# Altium schematic sheet AFE.SchDoc
size A; SheetNumber: 5; SheetTotal: 9
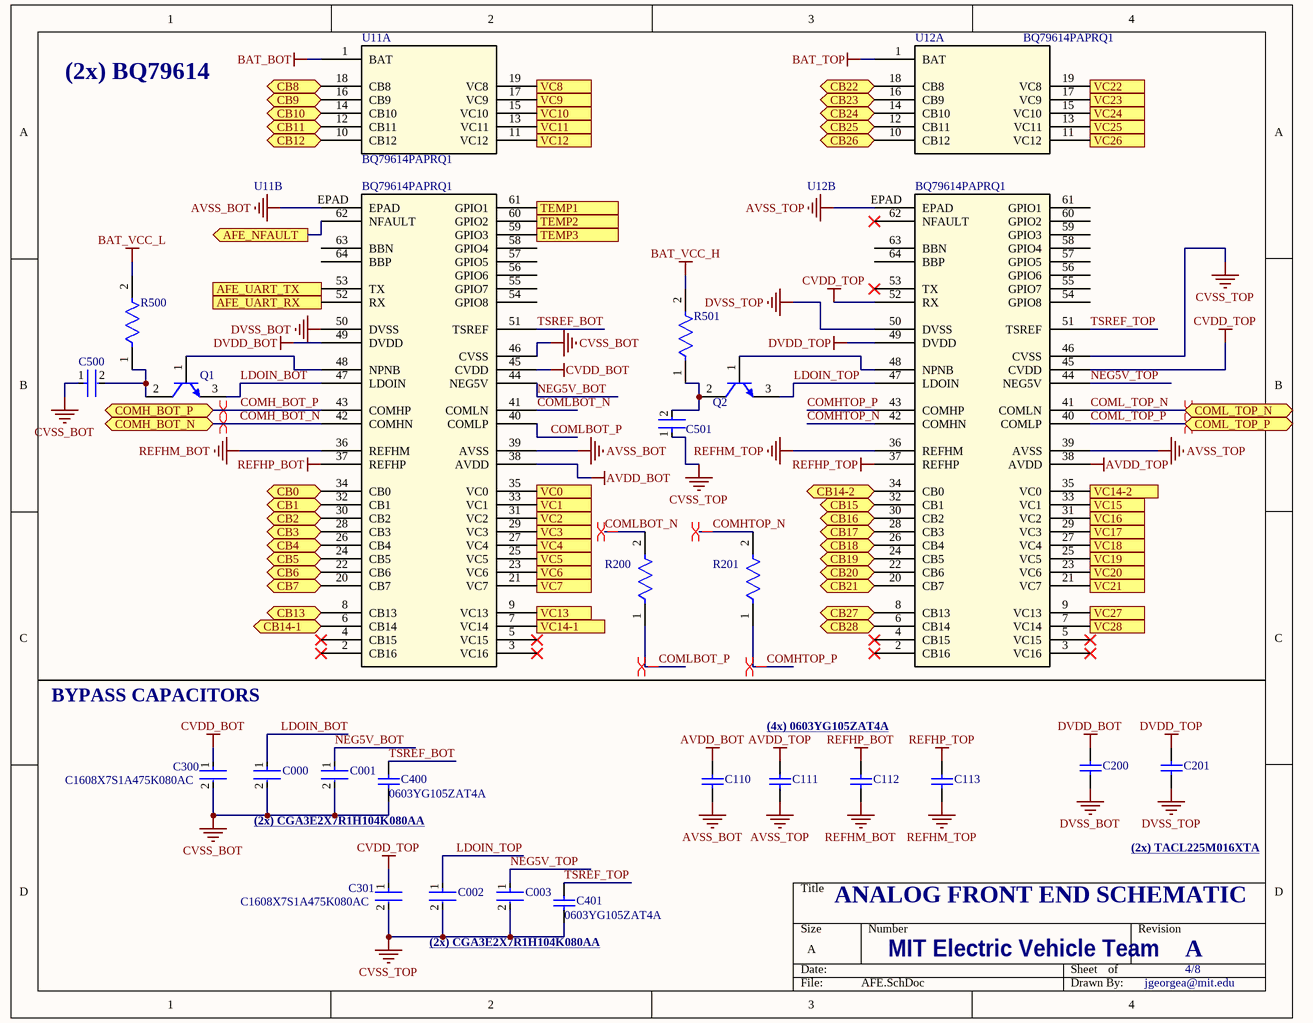
[diagram p0: AFE.SchDoc]

## Parts
C000  CGA3E2X7R1H104K080AA  [FP-CGA3E-0_3-0_1-IPC_A]  (value not drawn)
C001  CGA3E2X7R1H104K080AA  [FP-CGA3E-0_3-0_1-IPC_A]  (value not drawn)
C002  CGA3E2X7R1H104K080AA  [FP-CGA3E-0_3-0_1-IPC_A]  (value not drawn)
C003  CGA3E2X7R1H104K080AA  [FP-CGA3E-0_3-0_1-IPC_A]  (value not drawn)
C110  0603YG105ZAT4A  [CAPC1608X90X35ML15T15]  (value not drawn)
C111  0603YG105ZAT4A  [CAPC1608X90X35ML15T15]  (value not drawn)
C112  0603YG105ZAT4A  [CAPC1608X90X35ML15T15]  (value not drawn)
C113  0603YG105ZAT4A  [CAPC1608X90X35ML15T15]  (value not drawn)
C200  TACL225M016XTA  [CAPC1609X100X15ML20]  (value not drawn)
C201  TACL225M016XTA  [CAPC1609X100X15ML20]  (value not drawn)
C300  C1608X7S1A475K080AC  [FP-C1608-080-MFG]
C301  C1608X7S1A475K080AC  [FP-C1608-080-MFG]
C400  0603YG105ZAT4A  [CAPC1608X90X35ML15T15]
C401  0603YG105ZAT4A  [CAPC1608X90X35ML15T15]
C500  C0805C224J1RACTU  [FP-C0805C-DN-MFG]  (value not drawn)
C501  C0805C224J1RACTU  [FP-C0805C-DN-MFG]  (value not drawn)
Q1  2SC3646T-TD-E  [ONSC-SOT-89_PCP-1-3-419AU_V]  (value not drawn)
Q2  2SC3646T-TD-E  [ONSC-SOT-89_PCP-1-3-419AU_V]  (value not drawn)
R200  RC1608J102CS  [FP-RC1608-IPC_A]  (value not drawn)
R201  RC1608J102CS  [FP-RC1608-IPC_A]  (value not drawn)
R500  PCAN1206E1500BST5  [FP-PCAN1206-MFG]  (value not drawn)
R501  PCAN1206E1500BST5  [FP-PCAN1206-MFG]  (value not drawn)
U11  BQ79614PAPRQ1  [QFP_4PAPRQ1_TEX]  (parts A,B of 2)
U12  BQ79614PAPRQ1  [QFP_4PAPRQ1_TEX]  (parts A,B of 2)

## Ports
AFE_NFAULT (out, see BMS_top_level[2C], Communication[1C]), AFE_UART_RX (in, see BMS_top_level[2C], Communication[1C]), AFE_UART_TX (out, see BMS_top_level[2C], Communication[1B]), CB0 (bidir, see BMS_top_level[2A], Cell_Balancing[2A]), CB1 (bidir, see BMS_top_level[2A], Cell_Balancing[2A]), CB2 (bidir, see BMS_top_level[2A], Cell_Balancing[2A]), CB3 (bidir, see BMS_top_level[2A], Cell_Balancing[2B]), CB4 (bidir, see BMS_top_level[2A], Cell_Balancing[2B]), CB5 (bidir, see BMS_top_level[2A], Cell_Balancing[2B]), CB6 (bidir, see BMS_top_level[2A], Cell_Balancing[2C]), CB7 (bidir, see BMS_top_level[2A], Cell_Balancing[2C]), CB8 (bidir, see BMS_top_level[2A], Cell_Balancing[2C]), CB9 (bidir, see BMS_top_level[2A], Cell_Balancing[2D]), CB10 (bidir, see BMS_top_level[2A], Cell_Balancing[2D]), CB11 (bidir, see BMS_top_level[2A], Cell_Balancing[3A]), CB12 (bidir, see BMS_top_level[2A], Cell_Balancing[3A]), CB13 (bidir, see BMS_top_level[2A], Cell_Balancing[3A]), CB14-1 (bidir, see BMS_top_level[2B], Cell_Balancing[3B]), CB14-2 (bidir, see BMS_top_level[2B], Cell_Balancing[3B]), CB15 (bidir, see BMS_top_level[2B], Cell_Balancing[3B]), CB16 (bidir, see BMS_top_level[2B], Cell_Balancing[3C]), CB17 (bidir, see BMS_top_level[2B], Cell_Balancing[3C]), CB18 (bidir, see BMS_top_level[2B], Cell_Balancing[3C]), CB19 (bidir, see BMS_top_level[2B], Cell_Balancing[3D]), CB20 (bidir, see BMS_top_level[2B], Cell_Balancing[3D]), CB21 (bidir, see BMS_top_level[2B], Cell_Balancing[4A]), CB22 (bidir, see BMS_top_level[2B], Cell_Balancing[4A]), CB23 (bidir, see BMS_top_level[2B], Cell_Balancing[4A]), CB24 (bidir, see BMS_top_level[2B], Cell_Balancing[4B]), CB25 (bidir, see BMS_top_level[2B], Cell_Balancing[4B]), CB26 (bidir, see BMS_top_level[2B], Cell_Balancing[4B]), CB27 (bidir, see BMS_top_level[2B], Cell_Balancing[4C]), CB28 (bidir, see BMS_top_level[2B], Cell_Balancing[4C]), COMH_BOT_N (bidir, see BMS_top_level[2C], Communication[1B]), COMH_BOT_P (bidir, see BMS_top_level[2C], Communication[1A]), COML_TOP_N (bidir, see BMS_top_level[2C], Communication[3B]), COML_TOP_P (bidir, see BMS_top_level[2C], Communication[3A]), TEMP1 (in, see BMS_top_level[2B], Connectors#1[1C]), TEMP2 (in, see BMS_top_level[2B], Connectors#1[1C]), TEMP3 (in, see BMS_top_level[2B], Connectors#1[1C]), VC0 (in, see BMS_top_level[2C], Voltage_Sensing[1A]), VC1 (in, see BMS_top_level[2C], Voltage_Sensing[1A]), VC2 (in, see BMS_top_level[2C], Voltage_Sensing[1A]), VC3 (in, see BMS_top_level[2C], Voltage_Sensing[1B]), VC4 (in, see BMS_top_level[2C], Voltage_Sensing[1B]), VC5 (in, see BMS_top_level[2C], Voltage_Sensing[1B]), VC6 (in, see BMS_top_level[2C], Voltage_Sensing[1C]), VC7 (in, see BMS_top_level[2C], Voltage_Sensing[1C]), VC8 (in, see BMS_top_level[2C], Voltage_Sensing[1C]), VC9 (in, see BMS_top_level[2C], Voltage_Sensing[1D]), VC10 (in, see BMS_top_level[2C], Voltage_Sensing[1D]), VC11 (in, see BMS_top_level[2C], Voltage_Sensing[3A]), VC12 (in, see BMS_top_level[2C], Voltage_Sensing[3A]), VC13 (in, see BMS_top_level[2C], Voltage_Sensing[3A]), VC14-1 (in, see BMS_top_level[2C], Voltage_Sensing[3B]), VC14-2 (in, see BMS_top_level[2C], Voltage_Sensing[3B]), VC15 (in, see BMS_top_level[2D], Voltage_Sensing[3B]), VC16 (in, see BMS_top_level[2D], Voltage_Sensing[3C]), VC17 (in, see BMS_top_level[2D], Voltage_Sensing[3C]), VC18 (in, see BMS_top_level[2D], Voltage_Sensing[3C]), VC19 (in, see BMS_top_level[2D], Voltage_Sensing[3D]), VC20 (in, see BMS_top_level[2D], Voltage_Sensing[3D]), VC21 (in, see BMS_top_level[2D], Voltage_Sensing[4A]), VC22 (in, see BMS_top_level[2D], Voltage_Sensing[4A]), VC23 (in, see BMS_top_level[2D], Voltage_Sensing[4A]), VC24 (in, see BMS_top_level[2D], Voltage_Sensing[4B]), VC25 (in, see BMS_top_level[2D], Voltage_Sensing[4B]), VC26 (in, see BMS_top_level[2D], Voltage_Sensing[4B]), VC27 (in, see BMS_top_level[2D], Voltage_Sensing[4C]), VC28 (in, see BMS_top_level[2D], Voltage_Sensing[4C])

## Nets
AVDD_BOT: C110.2 U11.38(AVDD)
AVDD_TOP: C111.2 U12.38(AVDD)
AVSS_BOT: C110.1 U11.39(AVSS) U11.EPAD
AVSS_TOP: C111.1 U12.39(AVSS) U12.EPAD
BAT_BOT: U11.1(BAT)
BAT_TOP: U12.1(BAT)
BAT_VCC_H: R501.2
BAT_VCC_L: R500.2
CVDD_BOT: C300.1 U11.45(CVDD)
CVDD_TOP: C301.1 U12.45(CVDD) U12.52(RX)
CVSS_BOT: C000.2 C001.2 C300.2 C400.1 C500.1 U11.46(CVSS)
CVSS_TOP: C002.2 C003.2 C301.2 C401.1 C501.1 U12.46(CVSS)
DVDD_BOT: C200.1 U11.49(DVDD)
DVDD_TOP: C201.1 U12.49(DVDD)
DVSS_BOT: C200.2 U11.50(DVSS)
DVSS_TOP: C201.2 U12.50(DVSS)
REFHM_BOT: C112.1 U11.36(REFHM)
REFHM_TOP: C113.1 U12.36(REFHM)
REFHP_BOT: C112.2 U11.37(REFHP)
REFHP_TOP: C113.2 U12.37(REFHP)
AFE_NFAULT: U11.62(NFAULT) ; port AFE_NFAULT
AFE_UART_RX: U11.52(RX) ; port AFE_UART_RX
AFE_UART_TX: U11.53(TX) ; port AFE_UART_TX
CB0: U11.34(CB0) ; port CB0
CB1: U11.32(CB1) ; port CB1
CB2: U11.30(CB2) ; port CB2
CB3: U11.28(CB3) ; port CB3
CB4: U11.26(CB4) ; port CB4
CB5: U11.24(CB5) ; port CB5
CB6: U11.22(CB6) ; port CB6
CB7: U11.20(CB7) ; port CB7
CB8: U11.18(CB8) ; port CB8
CB9: U11.16(CB9) ; port CB9
CB10: U11.14(CB10) ; port CB10
CB11: U11.12(CB11) ; port CB11
CB12: U11.10(CB12) ; port CB12
CB13: U11.8(CB13) ; port CB13
CB14-1: U11.6(CB14) ; port CB14-1
CB14-2: U12.34(CB0) ; port CB14-2
CB15: U12.32(CB1) ; port CB15
CB16: U12.30(CB2) ; port CB16
CB17: U12.28(CB3) ; port CB17
CB18: U12.26(CB4) ; port CB18
CB19: U12.24(CB5) ; port CB19
CB20: U12.22(CB6) ; port CB20
CB21: U12.20(CB7) ; port CB21
CB22: U12.18(CB8) ; port CB22
CB23: U12.16(CB9) ; port CB23
CB24: U12.14(CB10) ; port CB24
CB25: U12.12(CB11) ; port CB25
CB26: U12.10(CB12) ; port CB26
CB27: U12.8(CB13) ; port CB27
CB28: U12.6(CB14) ; port CB28
COMH_BOT_N: U11.42(COMHN) ; port COMH_BOT_N
COMH_BOT_P: U11.43(COMHP) ; port COMH_BOT_P
COMHTOP_N: R201.2 U12.42(COMHN)
COMHTOP_P: R201.1 U12.43(COMHP)
COML_TOP_N: U12.41(COMLN) ; port COML_TOP_N
COML_TOP_P: U12.40(COMLP) ; port COML_TOP_P
COMLBOT_N: R200.2 U11.41(COMLN)
COMLBOT_P: R200.1 U11.40(COMLP)
LDOIN_BOT: C000.1 Q1.3(E) U11.47(LDOIN)
LDOIN_TOP: C002.1 Q2.3(E) U12.47(LDOIN)
NEG5V_BOT: C001.1 U11.44(NEG5V)
NEG5V_TOP: C003.1 U12.44(NEG5V)
TEMP1: U11.61(GPIO1) ; port TEMP1
TEMP2: U11.60(GPIO2) ; port TEMP2
TEMP3: U11.59(GPIO3) ; port TEMP3
TSREF_BOT: C400.2 U11.51(TSREF)
TSREF_TOP: C401.2 U12.51(TSREF)
VC0: U11.35(VC0) ; port VC0
VC1: U11.33(VC1) ; port VC1
VC2: U11.31(VC2) ; port VC2
VC3: U11.29(VC3) ; port VC3
VC4: U11.27(VC4) ; port VC4
VC5: U11.25(VC5) ; port VC5
VC6: U11.23(VC6) ; port VC6
VC7: U11.21(VC7) ; port VC7
VC8: U11.19(VC8) ; port VC8
VC9: U11.17(VC9) ; port VC9
VC10: U11.15(VC10) ; port VC10
VC11: U11.13(VC11) ; port VC11
VC12: U11.11(VC12) ; port VC12
VC13: U11.9(VC13) ; port VC13
VC14-1: U11.7(VC14) ; port VC14-1
VC14-2: U12.35(VC0) ; port VC14-2
VC15: U12.33(VC1) ; port VC15
VC16: U12.31(VC2) ; port VC16
VC17: U12.29(VC3) ; port VC17
VC18: U12.27(VC4) ; port VC18
VC19: U12.25(VC5) ; port VC19
VC20: U12.23(VC6) ; port VC20
VC21: U12.21(VC7) ; port VC21
VC22: U12.19(VC8) ; port VC22
VC23: U12.17(VC9) ; port VC23
VC24: U12.15(VC10) ; port VC24
VC25: U12.13(VC11) ; port VC25
VC26: U12.11(VC12) ; port VC26
VC27: U12.9(VC13) ; port VC27
VC28: U12.7(VC14) ; port VC28
NetC500_2: C500.2 Q1.2(C) R500.1
NetC501_2: C501.2 Q2.2(C) R501.1
NetQ1_1: Q1.1(B) U11.48(NPNB)
NetQ2_1: Q2.1(B) U12.48(NPNB)

Not connected (* = marked no-connect by the designer): U11 2(CB16)* 3(VC16)* 4(CB15)* 5(VC15)* 54(GPIO8) 55(GPIO7) 56(GPIO6) 57(GPIO5) 58(GPIO4) 63(BBN) 64(BBP); U12 2(CB16)* 3(VC16)* 4(CB15)* 5(VC15)* 53(TX)* 54(GPIO8) 55(GPIO7) 56(GPIO6) 57(GPIO5) 58(GPIO4) 59(GPIO3) 60(GPIO2) 61(GPIO1) 62(NFAULT)* 63(BBN) 64(BBP)

## Layout directives
differential pair: COMH_BOT_N, COMH_BOT_P, COMHTOP_N, COMHTOP_P, COML_TOP_N, COML_TOP_P, COMLBOT_N, COMLBOT_P

## Notes on the sheet
- (2x) BQ79614
- BYPASS CAPACITORS
- (4x) 0603YG105ZAT4A
- (2x) CGA3E2X7R1H104K080AA
- ANALOG FRONT END SCHEMATIC
- (2x) TACL225M016XTA
- MIT Electric Vehicle Team
- A
- 4/8
- jgeorgea@mit.edu

## Library data of the parts
C000 C001 C002 C003 = CMP-2000-07546-2: Cap Ceramic 100nF 50V X7R 10% Pad SMD 0603 +125°C Automotive T/R; Weight: 7.1E-05oz; Composition: Ceramic; Max Operating Temperature: 125°C; Termination: SMD/SMT; Dielectric: X7R; Length: 1.6mm; Package Quantity: 1; REACH SVHC: No SVHC; Lead Free: Lead Free; Case Code (Metric): 1608; Min Operating Temperature: -55°C; Packaging: Tape and Reel; Tolerance: 10%; Voltage Rating: 50V; Case Code (Imperial): 0603; Capacitance: 100nF; Case/Package: 0603; Voltage Rating (DC): 50V; Depth: 0.8mm; Radiation Hardening: No; Ratings: AEC-Q200; Mount: Surface Mount; Voltage: 50V; Thickness: 0.035inch; Width: 0.8mm; Height: 0.8mm
C110-C113 C400 C401 = CMP-2006-04543-1: Manufacturer: AVX Interconnect / Elco; Part Number: 0603YG105ZAT4A
C200 C201 = CMP-2006-00199-1: Manufacturer: AVX Interconnect / Elco; Part Number: TACL225M016XTA
C300 C301 = CMP-08246-005491-1: CAP CER 4.7UF 10V X7S 0603; Dielectric Material: Ceramic; Interface: I2C; Frequency: 48MHz; Memory Type: FLASH; Peripherals: Brown-out Detect/Reset; Tolerance: 10%; Oscillator Type: Internal; Number of I/Os: 53; Core Architecture: ARM; Memory Size: 64KB; Voltage Rating: 10V; Lead Free: Lead Free; Case Code (Imperial): 0603; Voltage Rating (DC): 10V; Series: Leopard Gecko; Min Operating Temperature: -40°C; Case/Package: LFBGA; Dielectric: X7S; RoHS Compliant: Yes; Package Quantity: 1000; Capacitance: 4.7uF; Thickness: 800um; Number of Pins: 64; REACH SVHC: No SVHC; Length: 1.6mm; Max Operating Temperature: 125°C; Depth: 0.8mm; Packaging: Tape and Reel; Case Code (Metric): 1608
C500 C501 = CMP-1036-04559-3: CAP CER 0.22UF 100V 5% X7R 0805; Manufacturer: KEMET; Tolerance: 0.05; Value: 0.22 μF; Temperature Coefficient: 30ppm/°C; Material: Ceramic; ComponentLink2URL: https://content.kemet.com/datasheets/KEM_C1003_C0G_SMD.pdf; Voltage Rating: 100 V; Temperature Range High: +125°C; Ipc Land Pattern Name: CAPC200125X78; Device Class L2: Capacitors; Temperature Range Low: -55°C; Automotive: No; RoHS: TRUE; ComponentLink2Description: Datasheet; Digikey Description: CAP CER 0.22UF 100V 5% X7R 0805; Category: Cap; Package: C0805C-DN; Temperature: -55°C to +125°C; Capacitance: 0.22 μF; Mouser Description: Multilayer Ceramic Capacitors MLCC - SMD/SMT 100volts 0.22uF X7R 5%; Temperature Characteristic: X7R; Device Class L1: Passive Components; Height: 0.88mm; Device Class L3: Ceramic Capacitors; Lead Free: Yes; Manufacturer Part Number: C0805C224J1RACTU; Octopart: https://octopart.com/c0805c224j1ractu-kemet-17138221
Q1 Q2 = CMP-1048-00948-1: Bipolar Transistor, 100 V, 1 A, Low VCE(sat), NPN Single, 3-Pin SOT-89, Pb-Free, Tape and Reel; Manufacturer: On Semiconductor; IC Continuous (A): 1; PartNumber: 2SC3646T-TD-E; RoHS: TRUE; Packing: Tape and Reel; ComponentLink2URL: http://www.onsemi.com/pub_link/Collateral/EN2005-D.PDF; ComponentLink3URL: http://www.onsemi.com/pub_link/Collateral/ENA1087-D.PDF; PackageReference: SOT-89_PCP-1-3-419AU; Mounting Technology: Surface Mount; ComponentLink1Description: Manufacturer URL; ComponentLink3Description: Package Specification; ComponentLink1URL: http://www.onsemi.com/; PackageDescription: 3-Pin Small Outline Transistor, Body 4.5 x 2.5 mm, Pitch 1.5 mm; Polarity: NPN; PackageVersion: Rev. O, 04/2012; ComponentLink2Description: Datasheet
R200 R201 = CMP-13261-002301-1: Res Thick Film 0603 1kΩ 5% 0.1W ±100ppm/°C Molded SMD T/R; Power Rating: 100mW; Resistance: 1kR; Voltage Rating (DC): 50V; Contact Plating: Tin; Mount: Surface Mount; Number of Terminations: 2; Features: Moisture Resistant; Max Power Dissipation: 100mW; Military Standard: Not; Case/Package: 0603; Radiation Hardening: No; Temperature Coefficient: 100ppm/°C; Length: 1.6mm; Height: 0.022inch; Case Code (Metric): 1608; Max Operating Temperature: 155°C; Composition: Thick Film; Tolerance: 5%; Width: 0.031inch; Depth: 0.8mm; Packaging: Tape and Reel; Lead Free: Lead Free; Case Code (Imperial): 0603; Min Operating Temperature: -55°C
R500 R501 = CMP-02407-000005-1: RES SMD 150 OHM 0.1% 2W 1206; Manufacturer: Vishay; Value: 150Ω; Temperature Coefficient: 25ppm/°C; Power Rating: 2000mW; Voltage Rating: 100V; Category: Res; Lead Free: Yes; Manufacturer Part Number: PCAN1206E1500BST5; Digikey Description: RES SMD 150 OHM 0.1% 2W 1206; Device Class L2: Resistors; Ipc Land Pattern Name: RESC320160X38; Package: PCAN1206; Tolerance: 0.1%; Temperature Range High: +155°C; Resistance: 150Ω; Composition: Thin Film; Series: PCAN; ComponentLink2URL: https://www.vishay.com/docs/60125/pcan.pdf; Octopart: https://octopart.com/pcan1206e1500bst5-vishay-47198091; RoHS: TRUE; Height: 0.018inch; Temperature Range Low: -55°C; Temperature: -55°C to +155°C; Device Class L1: Passive Components; Automotive: No; Device Class L3: Chip SMD Resistors; ComponentLink2Description: Datasheet
U11 U12 = BQ79614PAPRQ1: No Description Available; Mfr_Name: Texas Instruments; RefDes: RefDes; Type: Type